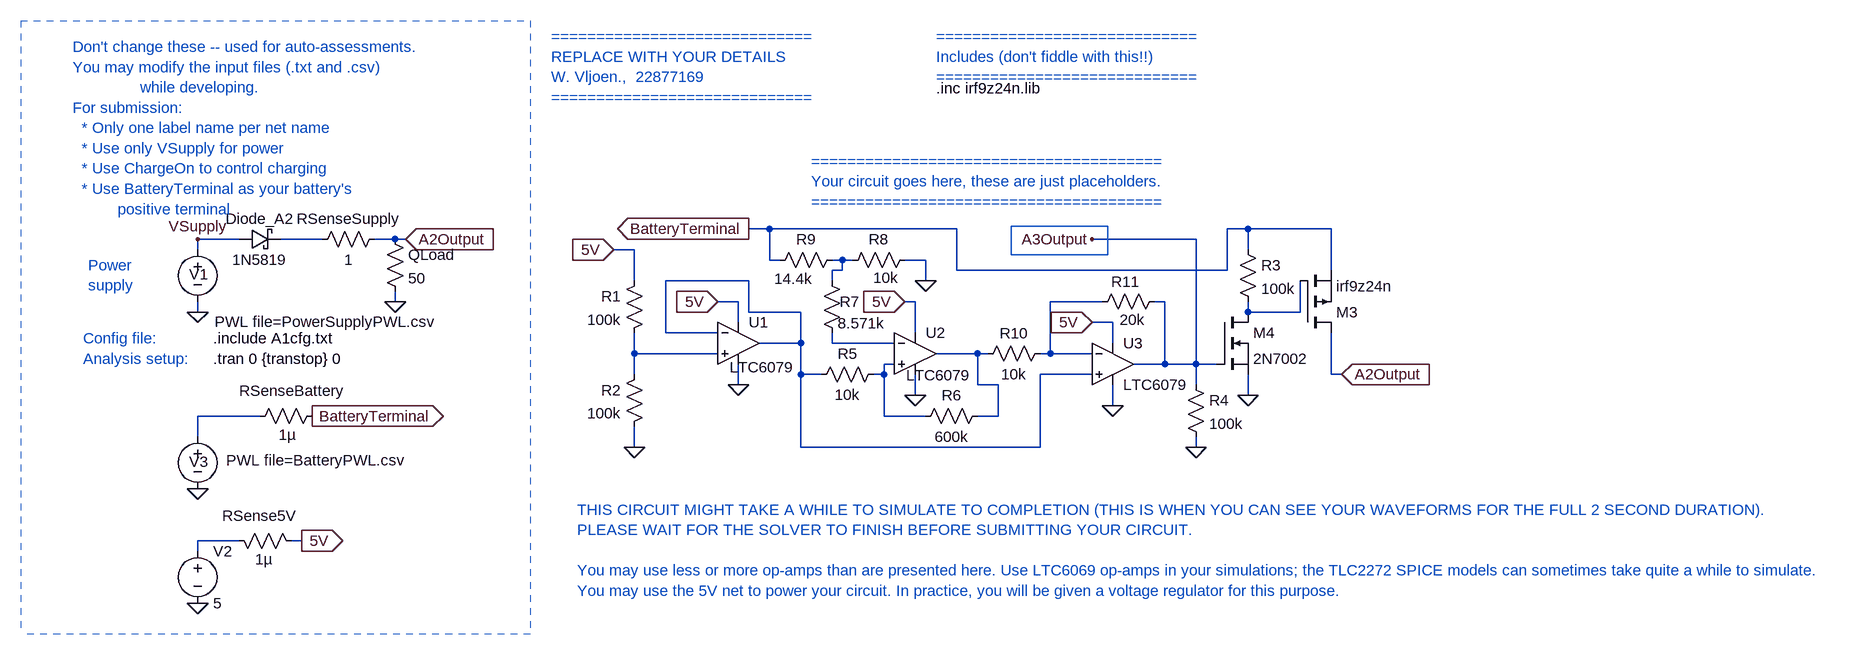
[diagram p0: schematic E344_22877169_A3.asc]
E344_22877169_A3.asc, the LTspice schematic file:
Version 4
SHEET 1 1824 680
WIRE -1216 -1104 -1248 -1104
WIRE -928 -1104 -1216 -1104
WIRE -480 -1104 -512 -1104
WIRE -352 -1104 -480 -1104
WIRE -2032 -1088 -2096 -1088
WIRE -1904 -1088 -1968 -1088
WIRE -1792 -1088 -1824 -1088
WIRE -1776 -1088 -1792 -1088
WIRE -560 -1088 -720 -1088
WIRE -2096 -1072 -2096 -1088
WIRE -1424 -1072 -1456 -1072
WIRE -480 -1072 -480 -1104
WIRE -1216 -1056 -1216 -1104
WIRE -1200 -1056 -1216 -1056
WIRE -1104 -1056 -1120 -1056
WIRE -1088 -1056 -1104 -1056
WIRE -976 -1056 -1008 -1056
WIRE -1104 -1040 -1104 -1056
WIRE -1104 -1040 -1120 -1040
WIRE -928 -1040 -928 -1104
WIRE -512 -1040 -512 -1104
WIRE -512 -1040 -928 -1040
WIRE -352 -1040 -352 -1104
WIRE -1424 -1024 -1424 -1072
WIRE -1248 -1024 -1376 -1024
WIRE -1120 -1024 -1120 -1040
WIRE -976 -1024 -976 -1056
WIRE -1792 -992 -1792 -1008
WIRE -1264 -992 -1296 -992
WIRE -992 -992 -1008 -992
WIRE -704 -992 -784 -992
WIRE -608 -992 -624 -992
WIRE -2096 -976 -2096 -992
WIRE -1248 -976 -1248 -1024
WIRE -1168 -976 -1248 -976
WIRE -480 -976 -480 -992
WIRE -400 -976 -400 -1024
WIRE -400 -976 -480 -976
WIRE -1264 -960 -1264 -992
WIRE -688 -960 -720 -960
WIRE -1376 -944 -1376 -1024
WIRE -1296 -944 -1376 -944
WIRE -992 -944 -992 -992
WIRE -1168 -928 -1168 -976
WIRE -1168 -928 -1232 -928
WIRE -1120 -928 -1120 -944
WIRE -1024 -928 -1120 -928
WIRE -688 -928 -688 -960
WIRE -1424 -912 -1424 -944
WIRE -1296 -912 -1424 -912
WIRE -896 -912 -960 -912
WIRE -880 -912 -896 -912
WIRE -784 -912 -784 -992
WIRE -784 -912 -800 -912
WIRE -720 -912 -784 -912
WIRE -1024 -896 -1040 -896
WIRE -608 -896 -608 -992
WIRE -608 -896 -656 -896
WIRE -560 -896 -560 -1088
WIRE -560 -896 -608 -896
WIRE -528 -896 -560 -896
WIRE -1424 -880 -1424 -912
WIRE -1168 -880 -1168 -928
WIRE -1136 -880 -1168 -880
WIRE -1040 -880 -1040 -896
WIRE -1040 -880 -1056 -880
WIRE -720 -880 -800 -880
WIRE -352 -880 -352 -944
WIRE -336 -880 -352 -880
WIRE -1264 -864 -1264 -896
WIRE -896 -864 -896 -912
WIRE -864 -864 -896 -864
WIRE -560 -864 -560 -896
WIRE -992 -848 -992 -880
WIRE -480 -848 -480 -880
WIRE -688 -832 -688 -864
WIRE -688 -832 -704 -832
WIRE -2000 -816 -2096 -816
WIRE -1040 -816 -1040 -880
WIRE -976 -816 -1040 -816
WIRE -864 -816 -864 -864
WIRE -864 -816 -896 -816
WIRE -2096 -784 -2096 -816
WIRE -1424 -768 -1424 -800
WIRE -1168 -768 -1168 -880
WIRE -800 -768 -800 -880
WIRE -800 -768 -1168 -768
WIRE -560 -768 -560 -784
WIRE -2032 -624 -2096 -624
WIRE -1936 -624 -1952 -624
WIRE -2096 -608 -2096 -624
FLAG -2096 -976 0
FLAG -1776 -1088 A2Output
IOPIN -1776 -1088 In
FLAG -1920 -816 BatteryTerminal
IOPIN -1920 -816 Out
FLAG -2096 -704 0
FLAG -1936 -624 5V
IOPIN -1936 -624 Out
FLAG -2096 -1088 VSupply
FLAG -1792 -992 0
FLAG -2096 -528 0
FLAG -1248 -1104 BatteryTerminal
IOPIN -1248 -1104 Out
FLAG -336 -880 A2Output
IOPIN -336 -880 In
FLAG -1296 -992 5V
IOPIN -1296 -992 In
FLAG -1456 -1072 5V
IOPIN -1456 -1072 In
FLAG -1424 -768 0
FLAG -1264 -864 0
FLAG -992 -848 0
FLAG -1008 -992 5V
IOPIN -1008 -992 In
FLAG -720 -960 5V
IOPIN -720 -960 In
FLAG -688 -832 0
FLAG -976 -1024 0
FLAG -560 -768 0
FLAG -480 -848 0
FLAG -720 -1088 A3Output
SYMBOL voltage -2096 -1088 R0
WINDOW 123 0 0 Left 0
WINDOW 39 0 0 Left 0
WINDOW 3 26 127 Left 2
WINDOW 0 -13 54 Left 2
SYMATTR Value PWL file=PowerSupplyPWL.csv
SYMATTR InstName V1
SYMBOL res -1904 -832 R90
WINDOW 0 -7 47 VBottom 2
WINDOW 3 29 54 VTop 2
SYMATTR InstName RSenseBattery
SYMATTR Value 1µ
SYMBOL schottky -2032 -1072 R270
WINDOW 0 32 32 VTop 2
WINDOW 3 0 32 VBottom 2
SYMATTR InstName Diode_A2
SYMATTR Value 1N5819
SYMATTR Description Diode
SYMATTR Type diode
SYMBOL voltage -2096 -800 R0
WINDOW 123 0 0 Left 0
WINDOW 39 0 0 Left 0
WINDOW 3 44 52 Left 2
WINDOW 0 -13 54 Left 2
SYMATTR Value PWL file=BatteryPWL.csv
SYMATTR InstName V3
SYMBOL res -1920 -1072 R270
WINDOW 0 32 56 VTop 2
WINDOW 3 0 56 VBottom 2
SYMATTR InstName RSenseSupply
SYMATTR Value 1
SYMBOL res -1808 -1104 R0
SYMATTR InstName QLoad
SYMATTR Value 50
SYMBOL voltage -2096 -624 R0
WINDOW 123 0 0 Left 0
WINDOW 39 0 0 Left 0
SYMATTR InstName V2
SYMATTR Value 5
SYMBOL res -2048 -640 M90
WINDOW 0 -7 47 VBottom 2
WINDOW 3 29 54 VTop 2
SYMATTR InstName RSense5V
SYMATTR Value 1µ
SYMBOL pmos -400 -944 M180
SYMATTR InstName M3
SYMATTR Value irf9z24n
SYMATTR Prefix X
SYMATTR SpiceModel irf9z24n
SYMBOL nmos -528 -976 R0
SYMATTR InstName M4
SYMATTR Value 2N7002
SYMBOL LTC6079 -992 -912 R0
WINDOW 3 -14 33 Left 2
SYMATTR InstName U2
SYMBOL LTC6079 -1264 -928 R0
WINDOW 3 -13 37 Left 2
SYMATTR InstName U1
SYMBOL LTC6079 -688 -896 R0
SYMATTR InstName U3
SYMBOL res -1408 -1040 M0
SYMATTR InstName R1
SYMATTR Value 100k
SYMBOL res -1408 -896 M0
SYMATTR InstName R2
SYMATTR Value 100k
SYMBOL res -1040 -896 R90
WINDOW 0 0 56 VBottom 2
WINDOW 3 32 56 VTop 2
SYMATTR InstName R5
SYMATTR Value 10k
SYMBOL res -992 -1072 R90
WINDOW 0 0 56 VBottom 2
WINDOW 3 28 45 VTop 2
SYMATTR InstName R8
SYMATTR Value 10k
SYMBOL res -1104 -1072 R90
WINDOW 0 0 56 VBottom 2
WINDOW 3 29 75 VTop 2
SYMATTR InstName R9
SYMATTR Value 14.4k
SYMBOL res -880 -832 R90
WINDOW 0 0 56 VBottom 2
WINDOW 3 32 56 VTop 2
SYMATTR InstName R6
SYMATTR Value 600k
SYMBOL res -784 -928 R90
WINDOW 0 0 56 VBottom 2
WINDOW 3 32 56 VTop 2
SYMATTR InstName R10
SYMATTR Value 10k
SYMBOL res -608 -1008 R90
WINDOW 0 1 60 VBottom 2
WINDOW 3 28 50 VTop 2
SYMATTR InstName R11
SYMATTR Value 20k
SYMBOL res -576 -880 R0
SYMATTR InstName R4
SYMATTR Value 100k
SYMBOL res -496 -1088 R0
SYMATTR InstName R3
SYMATTR Value 100k
SYMBOL res -1136 -1040 R0
WINDOW 0 28 48 Left 2
WINDOW 3 25 81 Left 2
SYMATTR InstName R7
SYMATTR Value 8.571k
TEXT -2072 -904 Left 2 !.tran 0 {transtop} 0
TEXT -2072 -936 Left 2 !.include A1cfg.txt
TEXT -2288 -1384 Left 2 ;Don't change these -- used for auto-assessments.\nYou may modify the input files (.txt and .csv) \n               while developing.\nFor submission: \n  * Only one label name per net name\n  * Use only VSupply for power\n  * Use ChargeOn to control charging\n  * Use BatteryTerminal as your battery's \n          positive terminal
TEXT -2272 -936 Left 2 ;Config file:
TEXT -2272 -904 Left 2 ;Analysis setup:
TEXT -2264 -1048 Left 2 ;Power\nsupply
TEXT -1552 -1400 Left 2 ;=============================\nREPLACE WITH YOUR DETAILS\nW. Vljoen.,  22877169\n=============================
TEXT -960 -1320 Left 2 !.inc irf9z24n.lib
TEXT -960 -1400 Left 2 ;=============================\nIncludes (don't fiddle with this!!)\n=============================
TEXT -1152 -1208 Left 2 ;=======================================\nYour circuit goes here, these are just placeholders.\n=======================================
TEXT -1512 -672 Left 2 ;THIS CIRCUIT MIGHT TAKE A WHILE TO SIMULATE TO COMPLETION (THIS IS WHEN YOU CAN SEE YOUR WAVEFORMS FOR THE FULL 2 SECOND DURATION).\nPLEASE WAIT FOR THE SOLVER TO FINISH BEFORE SUBMITTING YOUR CIRCUIT.\n \nYou may use less or more op-amps than are presented here. Use LTC6069 op-amps in your simulations; the TLC2272 SPICE models can sometimes take quite a while to simulate.\nYou may use the 5V net to power your circuit. In practice, you will be given a voltage regulator for this purpose.
LINE Normal -1584 -1424 -1584 -480 2
LINE Normal -2368 -1424 -1584 -1424 2
LINE Normal -1584 -480 -2368 -480 2
LINE Normal -1584 -496 -1584 -496 2
LINE Normal -2368 -1424 -2368 -480 2
RECTANGLE Normal -844 -1108 -696 -1064

The netlist it stands for:
* E344_22877169_A3.asc
V1 VSupply 0 PWL file=PowerSupplyPWL.csv
RSenseBattery BatteryTerminal N010 1µ
Diode_A2 VSupply N001 1N5819
V3 N010 0 PWL file=BatteryPWL.csv
RSenseSupply N001 A2Output 1
R§QLoad A2Output 0 50
V2 N011 0 5
RSense5V N011 5V 1µ
XM3 A2Output N005 BatteryTerminal irf9z24n irf9z24n  ; pins D G S
M4 N005 A3Output 0 0 2N7002
XU2 N009 N006 5V 0 N008 LTC6078  ; LTC6079, pins In+ In- V+ V- OUT
XU1 N007 N003 5V 0 N003 LTC6078  ; LTC6079, pins In+ In- V+ V- OUT
XU3 N003 N004 5V 0 A3Output LTC6078  ; LTC6079, pins In+ In- V+ V- OUT
R1 5V N007 100k
R2 N007 0 100k
R5 N009 N003 10k
R8 0 N002 10k
R9 N002 BatteryTerminal 14.4k
R6 N008 N009 600k
R10 N004 N008 10k
R11 A3Output N004 20k
R4 A3Output 0 100k
R3 BatteryTerminal N005 100k
R7 N002 N006 8.571k
.model D D
.lib standard.dio
.model NMOS NMOS
.model PMOS PMOS
.lib standard.mos
.tran 0 {transtop} 0
.include A1cfg.txt
* Don't change these -- used for auto-assessments.
* You may modify the input files (.txt and .csv)
*                while developing.
* For submission:
*   * Only one label name per net name
*   * Use only VSupply for power
*   * Use ChargeOn to control charging
*   * Use BatteryTerminal as your battery's
*           positive terminal
* Config file:
* Analysis setup:
* Power
* supply
* =============================
* REPLACE WITH YOUR DETAILS
* W. Vljoen.,  22877169
* =============================
.inc irf9z24n.lib
* =============================
* Includes (don't fiddle with this!!)
* =============================
* =======================================
* Your circuit goes here, these are just placeholders.
* =======================================
* THIS CIRCUIT MIGHT TAKE A WHILE TO SIMULATE TO COMPLETION (THIS IS WHEN YOU CAN SEE YOUR WAVEFORMS FOR THE FULL 2 SECOND DURATION).
* PLEASE WAIT FOR THE SOLVER TO FINISH BEFORE SUBMITTING YOUR CIRCUIT.
* You may use less or more op-amps than are presented here. Use LTC6069 op-amps in your simulations; the TLC2272 SPICE models can sometimes take quite a while to simulate.
* You may use the 5V net to power your circuit. In practice, you will be given a voltage regulator for this purpose.
.lib LTC5.lib
.backanno
.end